# EAGLE design door-sensor (EAGLE 8.7.1)
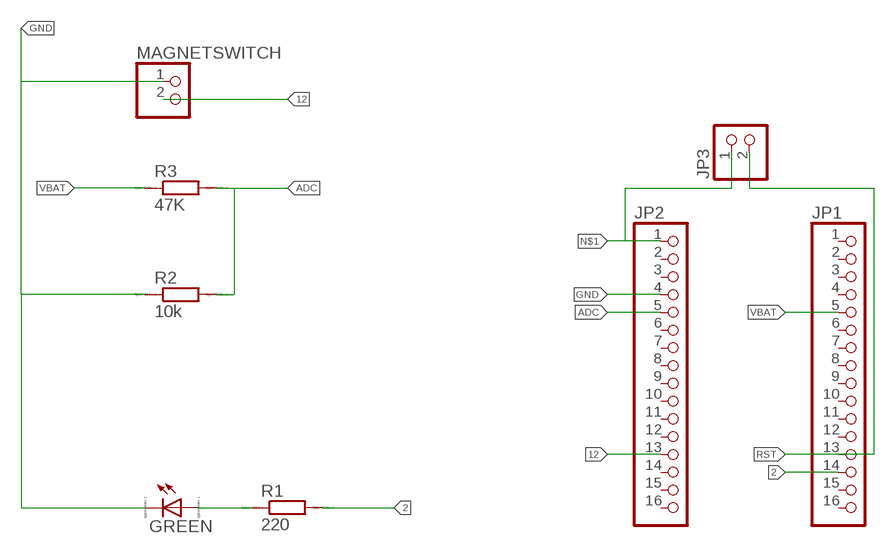
[diagram p0: schematic, sheet 1]

## Parts
GREEN  LED_ELD260  [LED_LD260]
JP1  PINHD-1X16  [1X16]
JP2  PINHD-1X16  [1X16]
JP3  PINHD-1X2  [1X02]
MAGNETSWITCH  PINHD-1X2  [1X02]
R1  220  R0204/7  [0204/7]
R2  10k  R0204/7  [0204/7]
R3  47K  R0204/7  [0204/7]

## Nets
2: JP1.14 R1.2
12: JP2.13 MAGNETSWITCH.2
ADC: JP2.5 R2.2 R3.2
GND: GREEN.K(C) JP2.4 MAGNETSWITCH.1 R2.1
N$1: JP2.1 JP3.1
N$5: GREEN.A R1.1
RST: JP1.13 JP3.2
VBAT: JP1.5 R3.1
Unconnected: JP1.1 JP1.2 JP1.3 JP1.4 JP1.6 JP1.7 JP1.8 JP1.9 JP1.10 JP1.11 JP1.12 JP1.15 JP1.16 JP2.2 JP2.3 JP2.6 JP2.7 JP2.8 JP2.9 JP2.10 JP2.11 JP2.12 JP2.14 JP2.15 JP2.16

## Library data of the parts
GREEN = eagle-ltspice:LED_E: LED Source: http://www.osram.convergy.de Source: www.luxeon.com Source: www.kingbright.com; SPICEMODEL: NONE; SPICEPREFIX: D; SPICETYPE: diode
JP1 JP2 = pinhead:PINHD-1X16: PIN HEADER
JP3 MAGNETSWITCH = pinhead:PINHD-1X2: PIN HEADER
R1-R3 = eagle-ltspice:R: RESISTOR, European symbol; SPICEMODEL: NONE; SPICEPREFIX: R

## Board
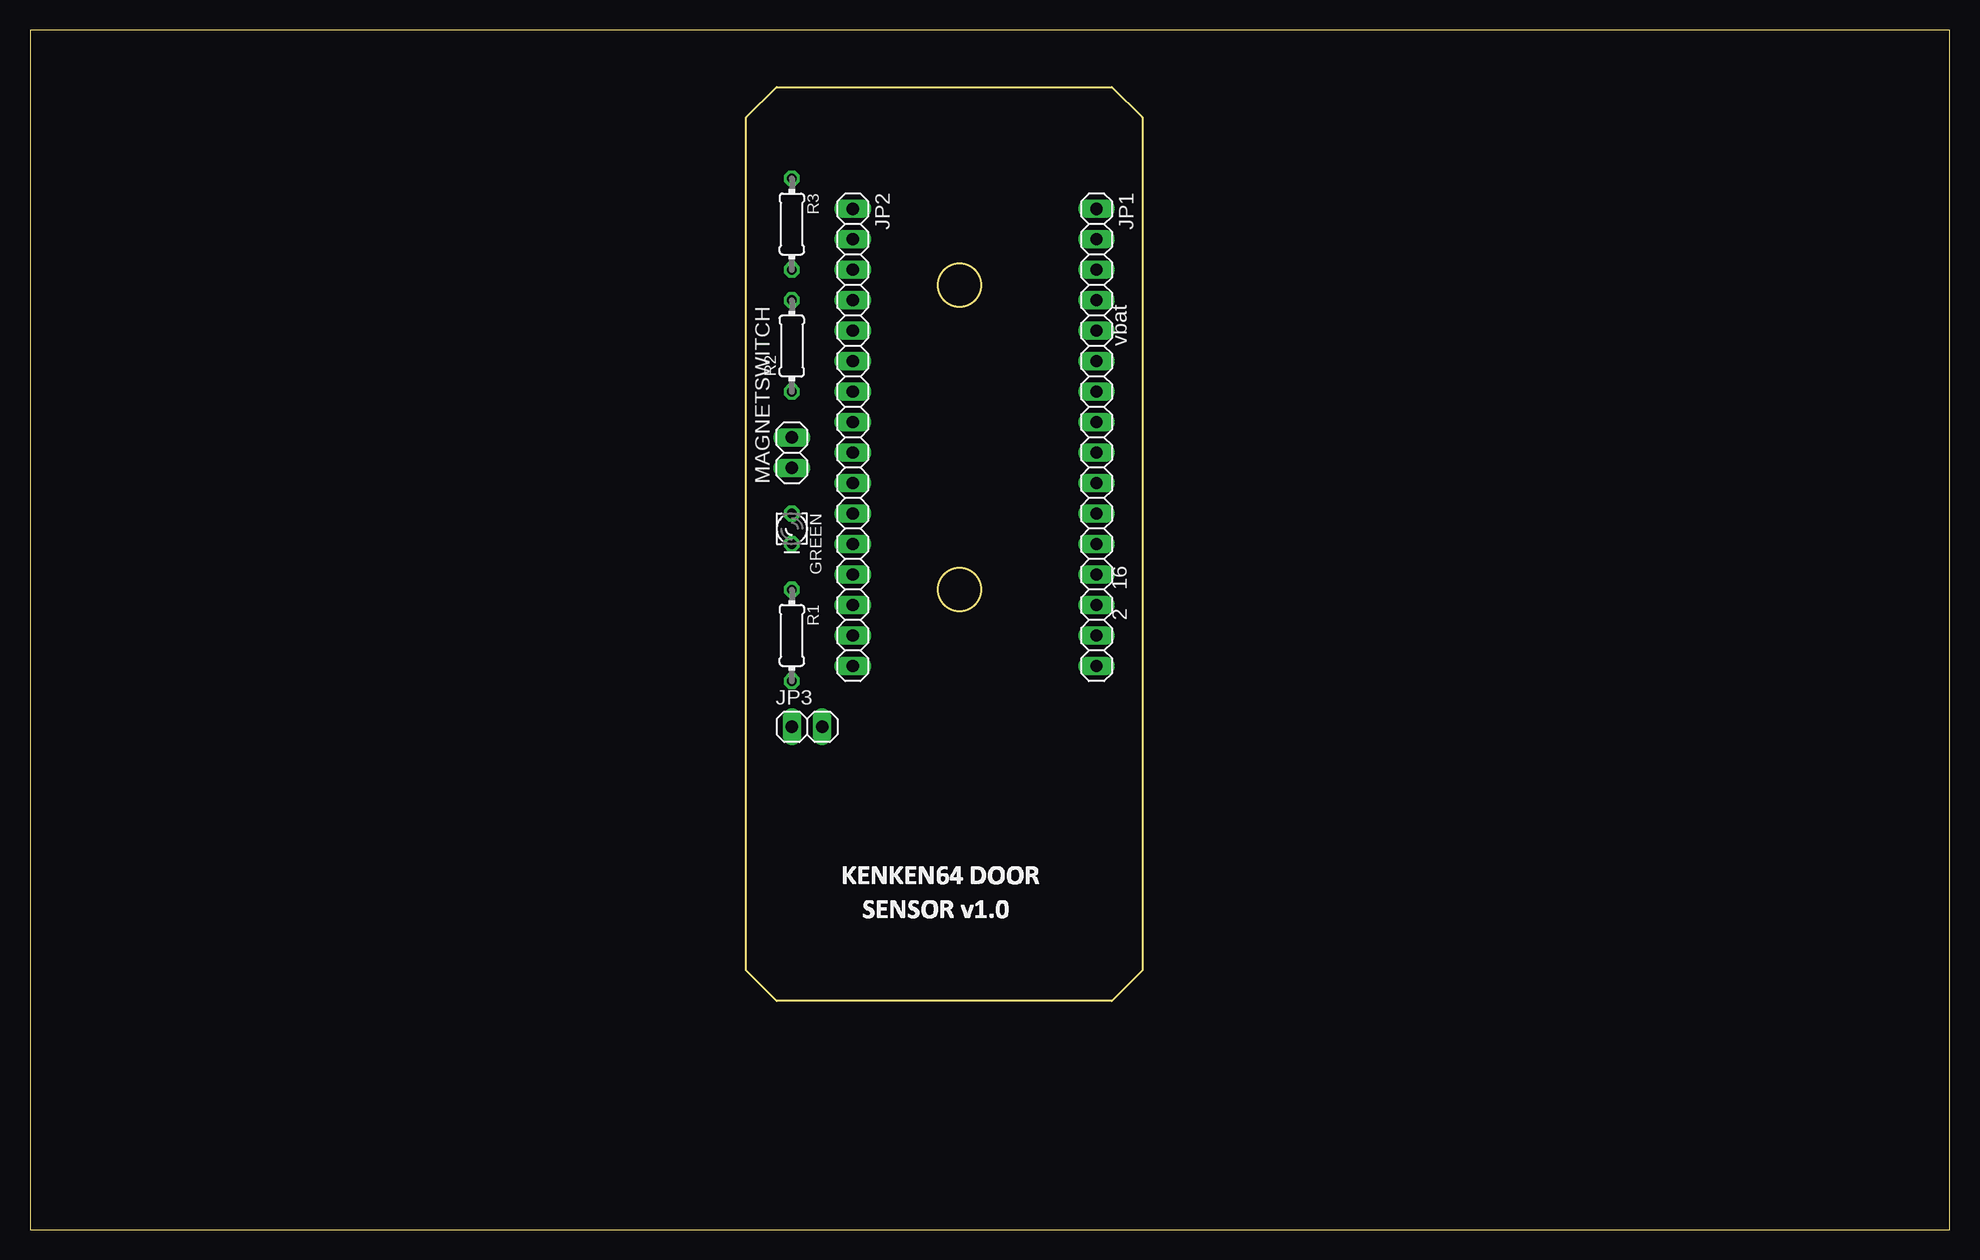
[diagram p1: board, top side]
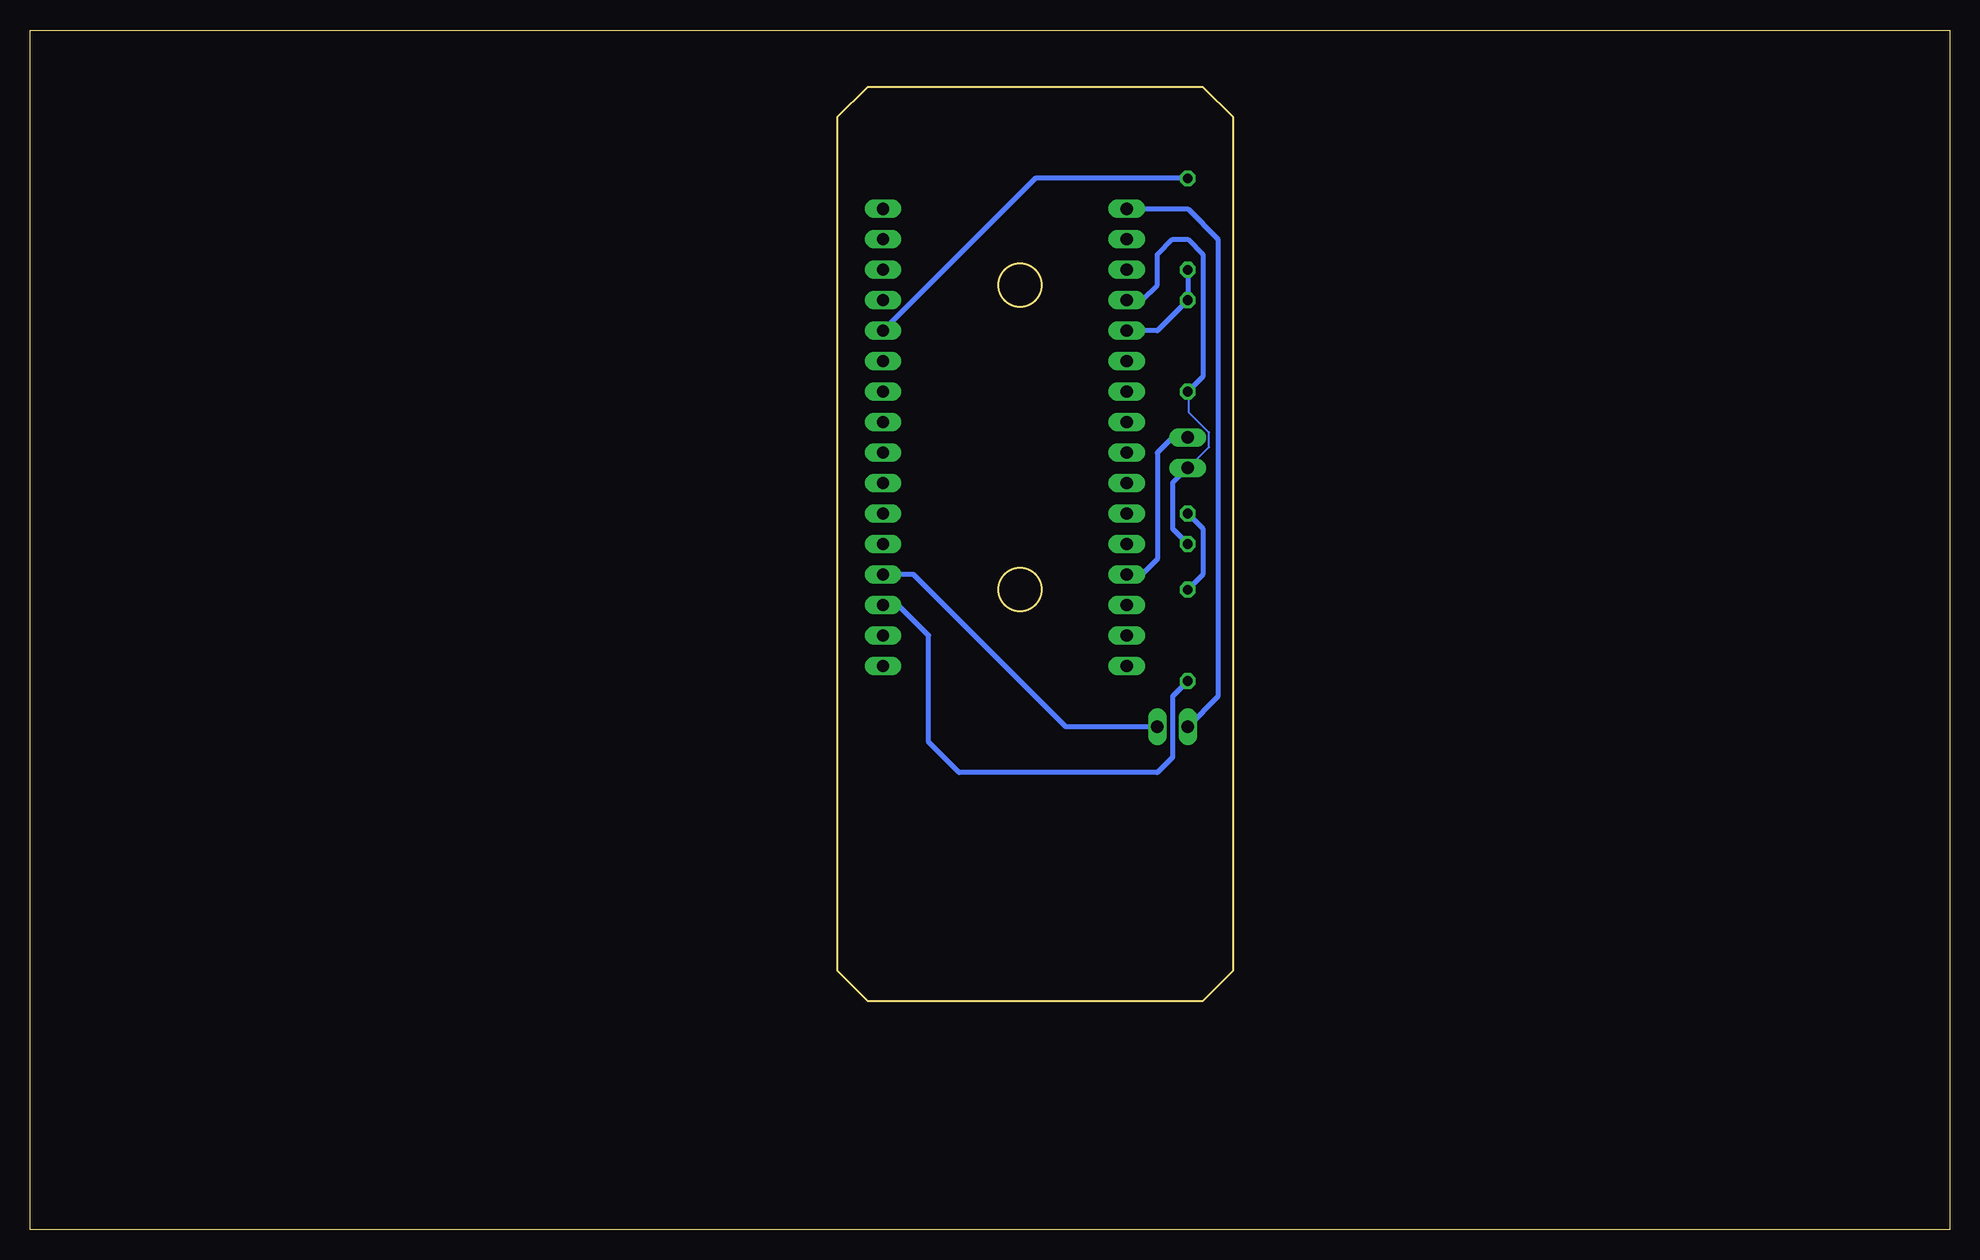
[diagram p2: board, bottom side, seen from below]

Size 160 x 100 mm. Coordinates in mm from the lower left corner, seen from the top.
Outline: 0,0 160,0 160,100 0,100 0,0
Outline: 62.23,95.25 90.17,95.25 92.71,92.71 92.71,21.59 90.17,19.05 62.23,19.05 59.69,21.59 59.69,92.71 62.23,95.25
Outline: circle at 77.47,78.74 radius 1.8
Outline: circle at 77.47,53.34 radius 1.8
Copper layers (1*16): Top 0.035mm / dielectric 1.5mm / Bottom 0.035mm
Design rules "default": minimum track width 6mil, minimum drill 0.35mm, track to track 6mil, track to pad 6mil, pad to pad 6mil, via to via 6mil, smd to smd 6mil, copper to edge 40mil, drill to drill 6mil, minimum pad ring 10mil, minimum via ring 8mil, stop-mask expansion 4mil, vias tented up to drill 0mil, thermal gap 10mil

### Footprints (pad centres in the part's own frame; a part is rotated, then mirrored left to right if it is on the bottom)
LED_LD260 = drill 0.813 octagon: A -1.27,0; K 1.27,0
1X16 = drill 1.016 long: 1 -19.05,0; 2 -16.51,0; 3 -13.97,0; 4 -11.43,0; 5 -8.89,0; 6 -6.35,0; 7 -3.81,0; 8 -1.27,0; 9 1.27,0; 10 3.81,0; 11 6.35,0; 12 8.89,0; 13 11.43,0; 14 13.97,0; 15 16.51,0; 16 19.05,0
1X02 = drill 1.016 long: 1 -1.27,0; 2 1.27,0
0204/7 = drill 0.813 octagon: 1 -3.81,0; 2 3.81,0

### Placement (x,y rotation side)
GREEN  63.5,58.42 270 top
JP1  88.9,66.04 270 top
JP2  68.58,66.04 270 top
JP3  64.77,41.91 0 top
MAGNETSWITCH  63.5,64.77 90 top
R1  63.5,49.53 270 top
R2  63.5,73.66 90 top
R3  63.5,83.82 270 top

### Tracks (layer width: path | path; a pad name or v marks a point on that pad's centre or on a via)
2
  Bottom 0.406: R1.2 64.77,44.45 64.77,39.37 66.04,38.1 82.55,38.1 85.09,40.64 85.09,49.53 87.63,52.07 JP1.14
12
  Bottom 0.406: MAGNETSWITCH.2 64.77,66.04 66.04,64.77 66.04,55.88 67.31,54.61 JP2.13
ADC
  Bottom 0.406: R3.2 R2.2 66.04,74.93 JP2.5
GND
  Bottom 0.152: R2.1 63.4,69.8 63.4,68.12 61.72,66.45 61.72,65.23 63.4,63.55 MAGNETSWITCH.1
  Bottom 0.406: MAGNETSWITCH.1 64.77,62.23 64.77,58.42 GREEN.K | JP2.4 67.31,77.47 66.04,78.74 66.04,81.28 64.77,82.55 63.5,82.55 62.23,81.28 62.23,71.12 R2.1
N$1
  Bottom 0.406: JP2.1 63.5,85.09 60.98,82.58 60.98,44.42 JP3.1
N$5
  Bottom 0.406: GREEN.A 62.23,58.42 62.23,54.61 R1.1
RST
  Bottom 0.406: JP3.2 73.66,41.91 86.36,54.61 JP1.13
VBAT
  Bottom 0.406: R3.1 76.2,87.63 JP1.5

### Text on the board
tPlace: vbat | 16 | 2 | D:/Projects/iot-door-sensor/pcb-design/pcb_logo.bmp